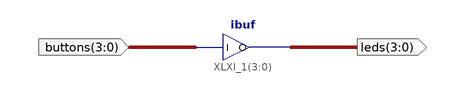
[diagram p0: schematic sheet 1]
// Xilinx ISE schematic edit_library.sch (spartan6) as structural Verilog: 1 symbols, 2 ports
module edit_library (
  input  [3:0] buttons,
  output [3:0] leds
);

  ibuf XLXI_1[3:0] (.I(buttons), .O(leds));
endmodule
